# EAGLE design 513_lora_raspberrypi (EAGLE 8.5.1)
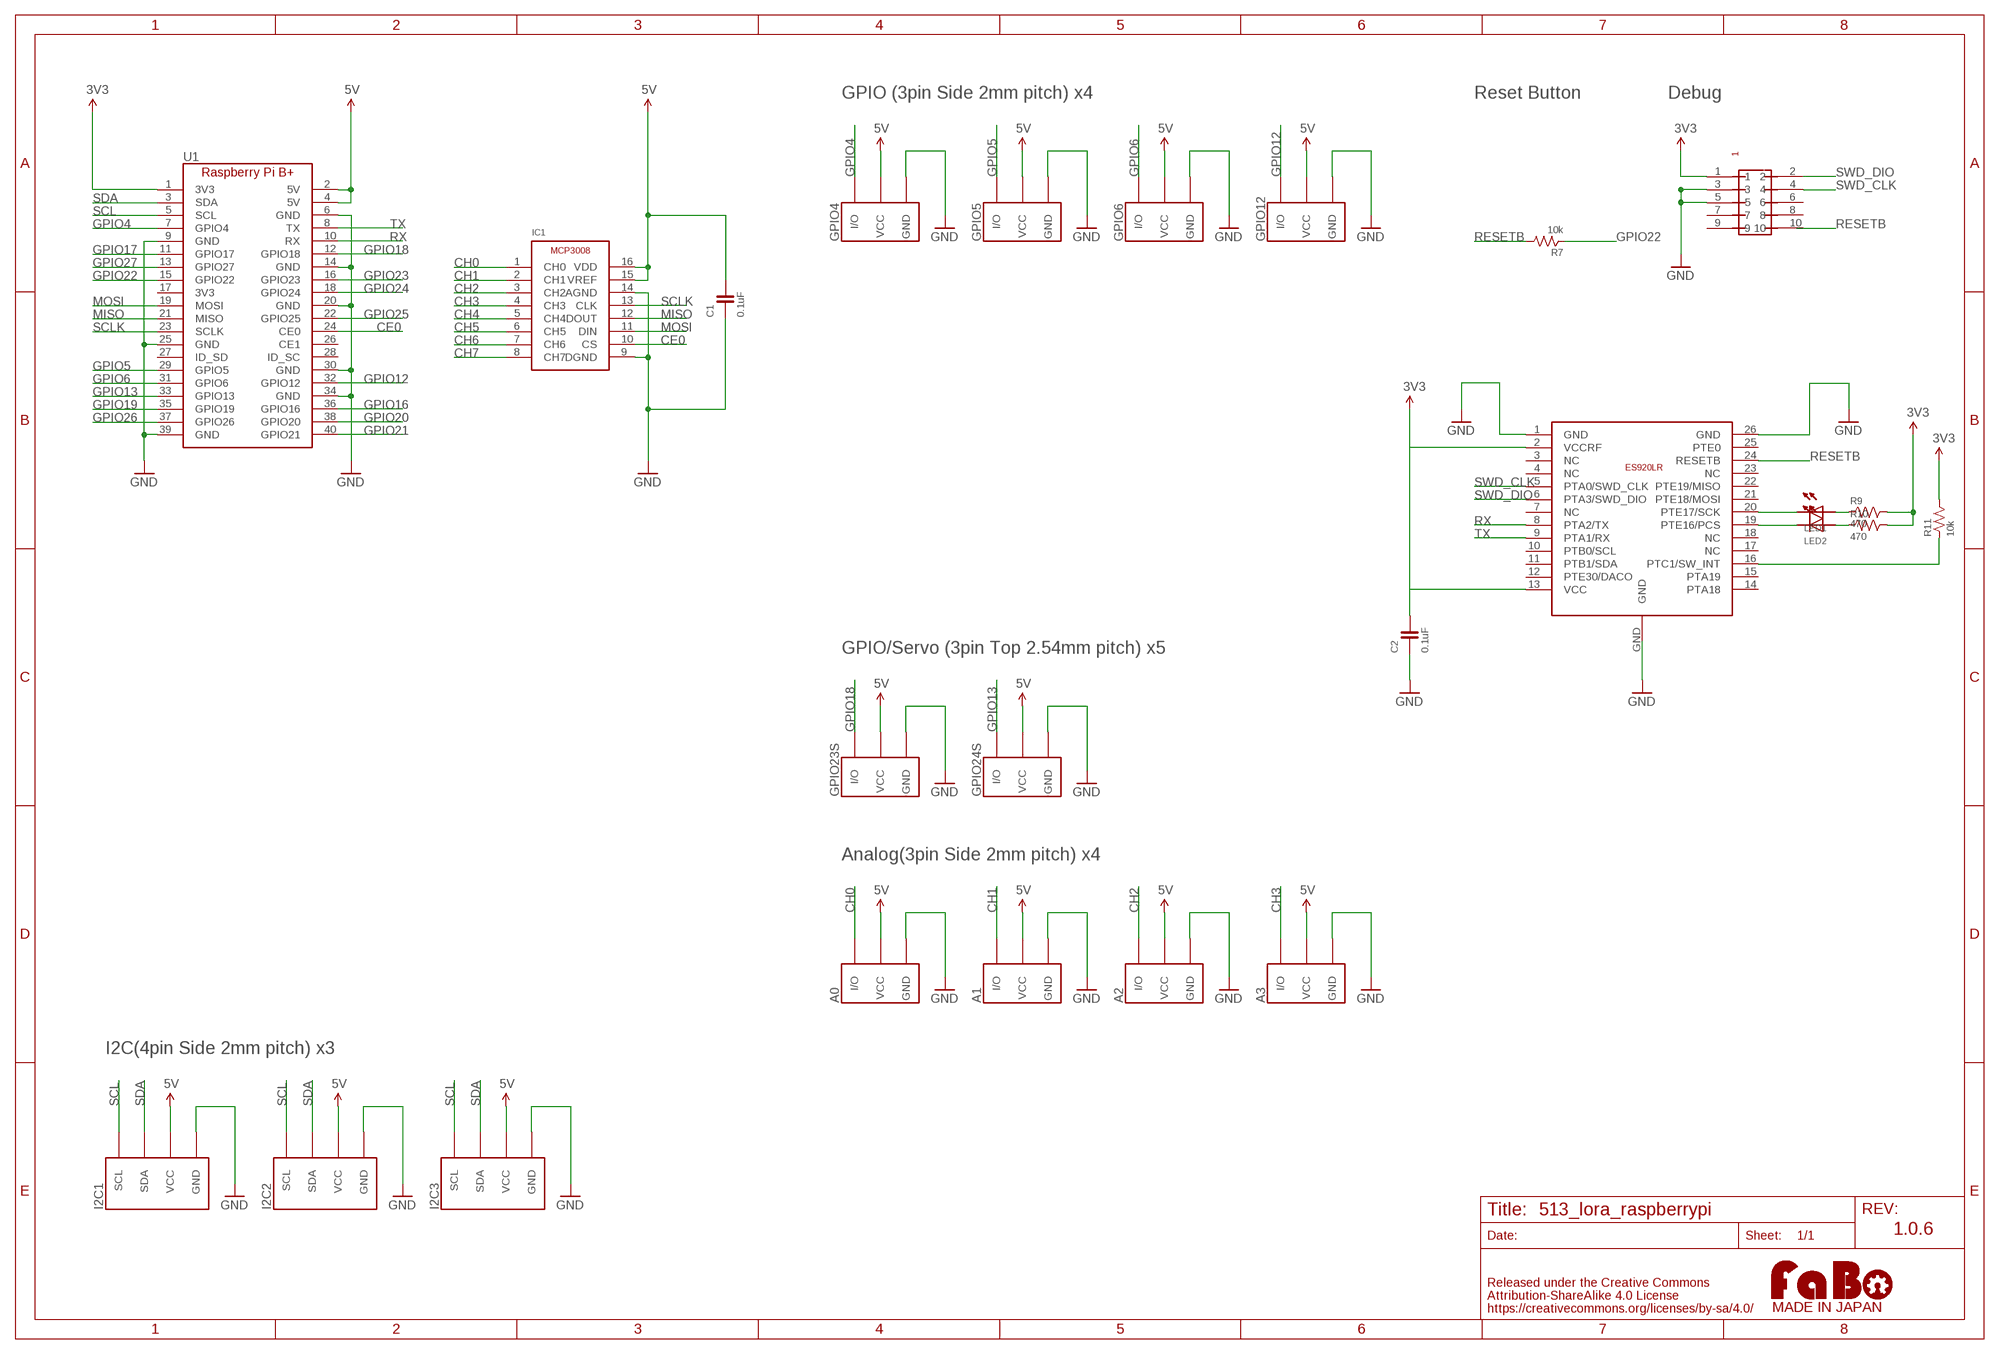
[diagram p0: schematic, sheet 1]

## Parts
A0  FABO_BRICK_3PIN-B03B-PASK-1  [FABO_BRICK_3PIN_B03B-PASK-1]
A1  FABO_BRICK_3PIN-B03B-PASK-1  [FABO_BRICK_3PIN_B03B-PASK-1]
A2  FABO_BRICK_3PIN-B03B-PASK-1  [FABO_BRICK_3PIN_B03B-PASK-1]
A3  FABO_BRICK_3PIN-B03B-PASK-1  [FABO_BRICK_3PIN_B03B-PASK-1]
C1  0.1uF  CAPACITOR-0603  [0603]
C2  0.1uF  CAPACITOR-0603_NARROW  [0603-NARROW]
GPIO4  FABO_BRICK_3PIN-S03B-PASK-2  [FABO_BRICK_3PIN_S03B-PASK-2]
GPIO5  FABO_BRICK_3PIN-S03B-PASK-2  [FABO_BRICK_3PIN_S03B-PASK-2]
GPIO6  FABO_BRICK_3PIN-S03B-PASK-2  [FABO_BRICK_3PIN_S03B-PASK-2]
GPIO12  FABO_BRICK_3PIN-S03B-PASK-2  [FABO_BRICK_3PIN_S03B-PASK-2]
GPIO23S  FABO_BRICK_3PIN-HEADER  [FABO_BRICK_3PIN_HEADER]
GPIO24S  FABO_BRICK_3PIN-HEADER  [FABO_BRICK_3PIN_HEADER]
I2C1  FABO_BRICK_I2C-S04B-PASK-2  [FABO_BRICK_I2C_S04B-PASK-2]
I2C2  FABO_BRICK_I2C-S04B-PASK-2  [FABO_BRICK_I2C_S04B-PASK-2]
I2C3  FABO_BRICK_I2C-S04B-PASK-2  [FABO_BRICK_I2C_S04B-PASK-2]
IC1  MICROCHIP-MCP3008  [MICROCHIP-MCP3008]
LED1  LED-0603  [0603]
LED2  LED-0603  [0603]
R7  10k  RESISTOR-0603-NARROW  [0603-NARROW]
R9  470  RESISTOR-0603-NARROW  [0603-NARROW]
R10  470  RESISTOR-0603-NARROW  [0603-NARROW]
R11  10k  RESISTOR-0603-NARROW  [0603-NARROW]
U1  RASPBERRY_PI_B+  [RASPBERRY_PI_B+]
U$14  LOGO_FABO-M  [LOGO_FABO_MS]
U$15  PIN-HEADER-SMT(1.27MM)2X5  [PIN-HEADER-SMT(1.27MM)2X5]
U$16  ES920LR  [ES920LR]

## Nets
3V3: C2.2 R9.2 R10.2 R11.2 U1.1(3V3) U$15.1 U$16.2(VCCRF) U$16.13(VCC)
5V: A0.VCC A1.VCC A2.VCC A3.VCC C1.2 GPIO4.VCC GPIO5.VCC GPIO6.VCC GPIO12.VCC GPIO23S.VCC GPIO24S.VCC I2C1.VCC I2C2.VCC I2C3.VCC IC1.15(VREF) IC1.16(VDD) U1.2(5V) U1.4(5V)
CE0: IC1.10(CS) U1.24(CE0)
CH0: A0.I/O IC1.1(CH0)
CH1: A1.I/O IC1.2(CH1)
CH2: A2.I/O IC1.3(CH2)
CH3: A3.I/O IC1.4(CH3)
CH4: IC1.5(CH4)
CH5: IC1.6(CH5)
CH6: IC1.7(CH6)
CH7: IC1.8(CH7)
GND: A0.GND A1.GND A2.GND A3.GND C1.1 C2.1 GPIO4.GND GPIO5.GND GPIO6.GND GPIO12.GND GPIO23S.GND GPIO24S.GND I2C1.GND I2C2.GND I2C3.GND IC1.9(DGND) IC1.14(AGND) U1.6(GND) U1.9(GND) U1.14(GND) U1.20(GND) U1.25(GND) U1.30(GND) U1.34(GND) U1.39(GND) U$15.3 U$15.5 U$16.1(GND) U$16.26(GND) U$16.GND
GPIO4: GPIO4.I/O U1.7(GPIO4)
GPIO5: GPIO5.I/O U1.29(GPIO5)
GPIO6: GPIO6.I/O U1.31(GPIO6)
GPIO12: GPIO12.I/O U1.32(GPIO12)
GPIO13: GPIO24S.I/O U1.33(GPIO13)
GPIO16: U1.36(GPIO16)
GPIO17: U1.11(GPIO17)
GPIO18: GPIO23S.I/O U1.12(GPIO18)
GPIO19: U1.35(GPIO19)
GPIO20: U1.38(GPIO20)
GPIO21: U1.40(GPIO21)
GPIO22: R7.1 U1.15(GPIO22)
GPIO23: U1.16(GPIO23)
GPIO24: U1.18(GPIO24)
GPIO25: U1.22(GPIO25)
GPIO26: U1.37(GPIO26)
GPIO27: U1.13(GPIO27)
MISO: IC1.12(DOUT) U1.21(MISO)
MOSI: IC1.11(DIN) U1.19(MOSI)
N$4: LED2.CATHODE U$16.19(PTE16/PCS)
N$5: LED1.CATHODE U$16.20(PTE17/SCK)
N$6: LED1.ANODE R9.1
N$7: LED2.ANODE R10.1
N$8: R11.1 U$16.16(PTC1/SW_INT)
RESETB: R7.2 U$15.10 U$16.24(RESETB)
RX: U1.10(RX) U$16.8(PTA2/TX)
SCL: I2C1.SCL I2C2.SCL I2C3.SCL U1.5(SCL)
SCLK: IC1.13(CLK) U1.23(SCLK)
SDA: I2C1.SDA I2C2.SDA I2C3.SDA U1.3(SDA)
SWD_CLK: U$15.4 U$16.5(PTA0/SWD_CLK)
SWD_DIO: U$15.2 U$16.6(PTA3/SWD_DIO)
TX: U1.8(TX) U$16.9(PTA1/RX)
Unconnected: U1.17(3V3) U1.26(CE1) U1.27(ID_SD) U1.28(ID_SC) U$15.6 U$15.7 U$15.8 U$15.9 U$16.3(NC) U$16.4(NC) U$16.7(NC) U$16.10(PTB0/SCL) U$16.11(PTB1/SDA) U$16.12(PTE30/DACO) U$16.14(PTA18) U$16.15(PTA19) U$16.17(NC) U$16.18(NC) U$16.21(PTE18/MOSI) U$16.22(PTE19/MISO) U$16.23(NC) U$16.25(PTE0)

## Notes on the sheet
- GPIO (3pin Side 2mm pitch) x4 | Reset Button | Debug
- GPIO/Servo (3pin Top 2.54mm pitch) x5
- Analog(3pin Side 2mm pitch) x4
- I2C(4pin Side 2mm pitch) x3
- 1.0.6

## Library data of the parts
A0 A1-A3 GPIO4-GPIO6 GPIO12 GPIO23S GPIO24S = FaBo-Template:FABO_BRICK_3PIN: FaBo Brick 3pin
C1 C2 = FaBo-Capacitor:CAPACITOR: CAPACITOR
I2C1-I2C3 = FaBo-Template:FABO_BRICK_I2C: FaBo Brick I2C
IC1 = FaBo-ADC:MICROCHIP-MCP3008
LED1 LED2 = FaBo-LED:LED
R7 R9-R11 = FaBo-Resistors:RESISTOR: RESISTOR
U1 = FaBo-Boards:RASPBERRY_PI_B+
U$14 = FaBo-etc:LOGO_FABO
U$15 = GClue:PIN-HEADER-SMT(1.27MM)2X5: PIN-HEADER-SMT (1.27MM) 2x5
U$16 = FaBo-LoRa:ES920LR

## Board
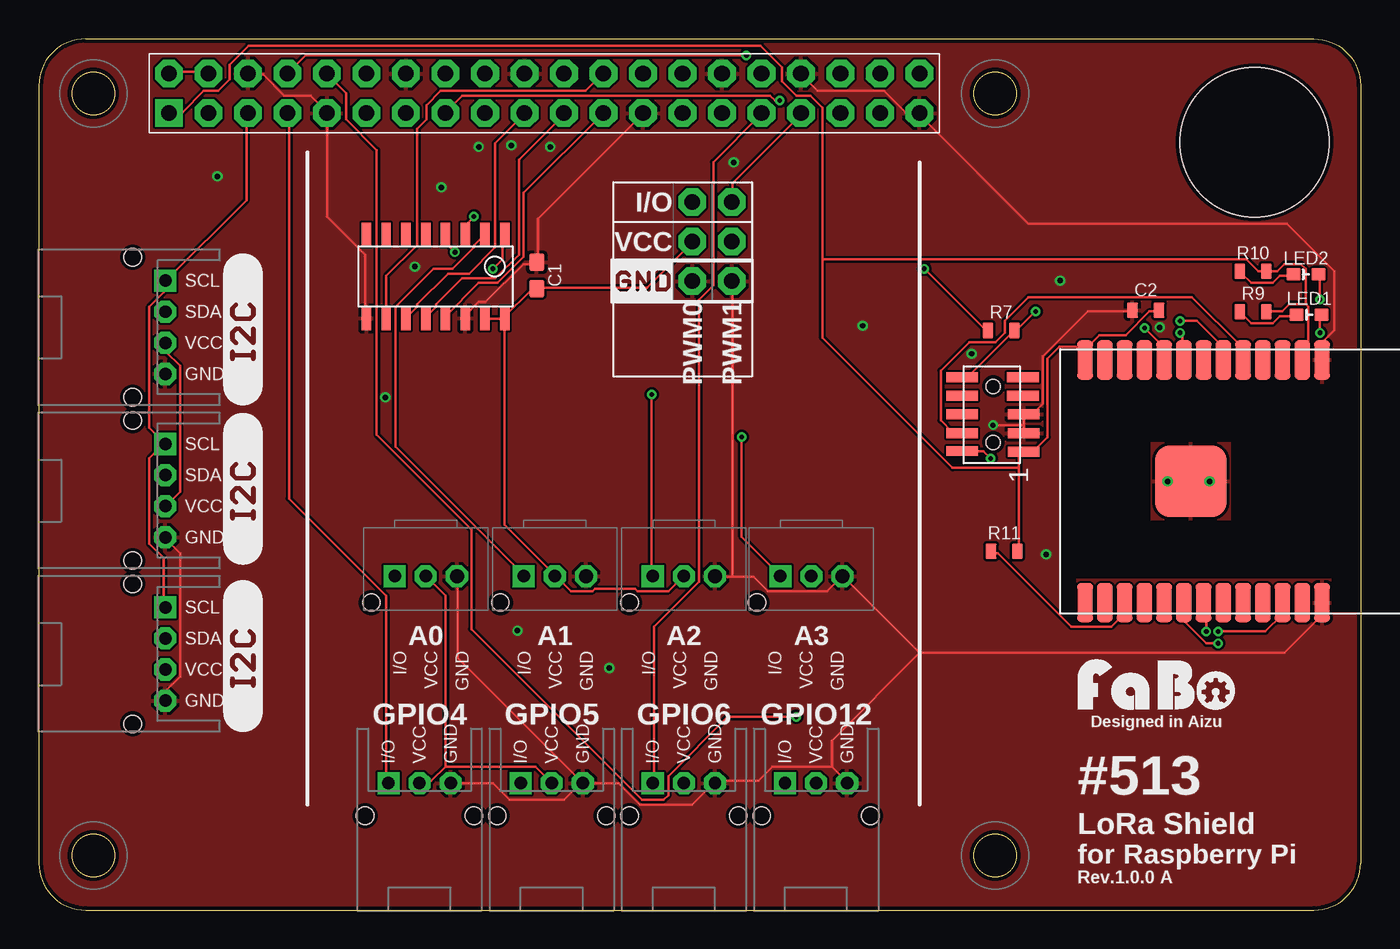
[diagram p1: board, top side]
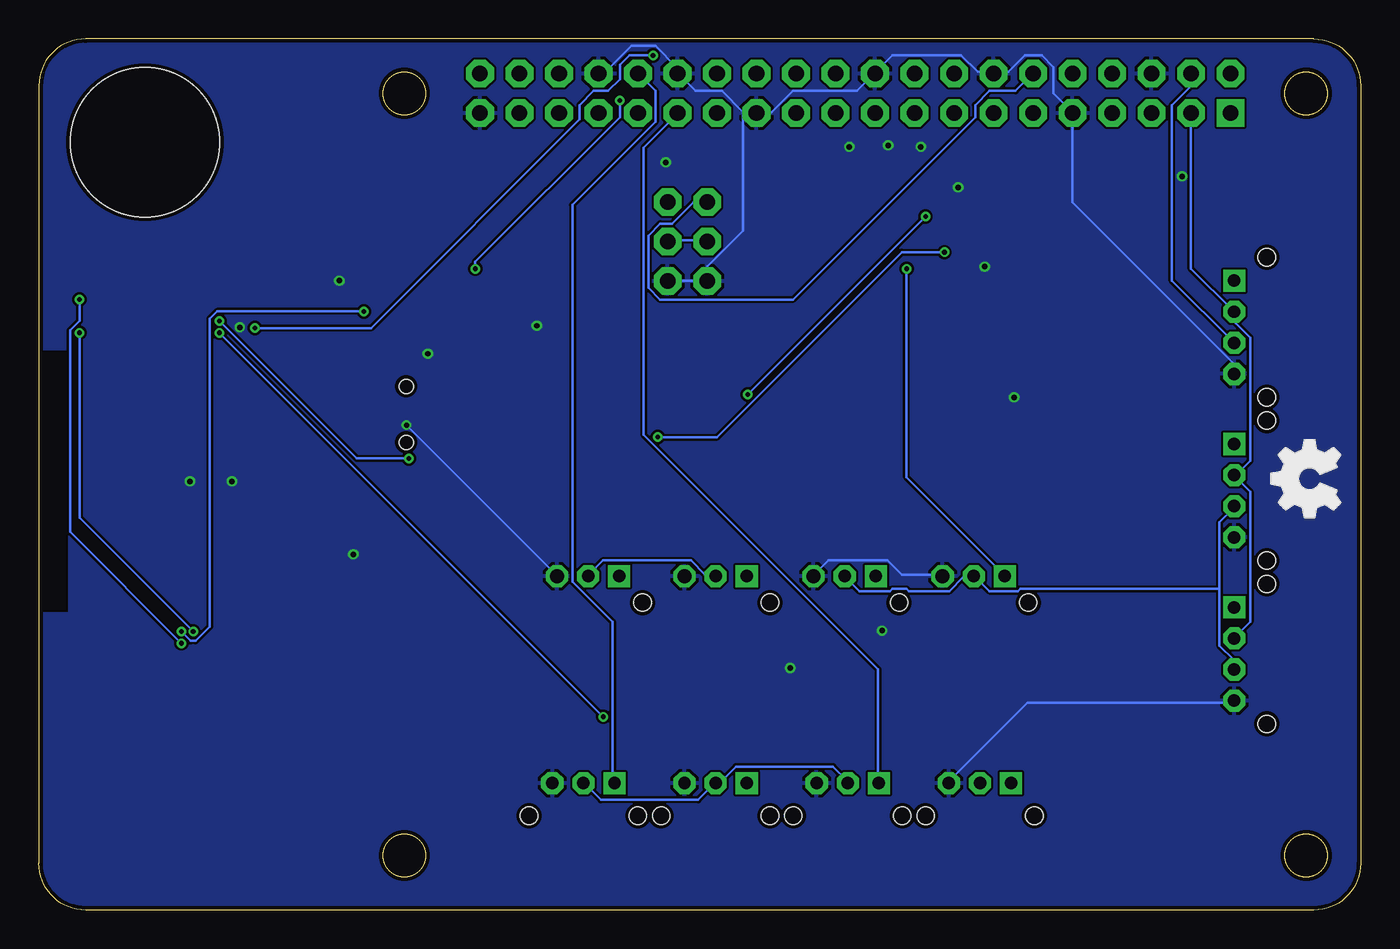
[diagram p2: board, bottom side, seen from below]

Size 85 x 56 mm. Coordinates in mm from the lower left corner, seen from the top.
Copper layers (1*16): Top 0.035mm / dielectric 1.6mm / Bottom 0.035mm
Design rules "PCBway": minimum track width 6mil, minimum drill 12mil, track to track 6mil, track to pad 6mil, pad to pad 6mil, via to via 6mil, smd to smd 6mil, copper to edge 10mil, drill to drill 10mil, minimum pad ring 10mil, minimum via ring 6mil, stop-mask expansion 2mil, vias tented up to drill 100mil, thermal gap 8mil
Holes 9.6 mm at 78.18,49.36

### Footprints (pad centres in the part's own frame; a part is rotated, then mirrored left to right if it is on the bottom)
FABO_BRICK_3PIN_B03B-PASK-1 = drill 0.9 pad 1.422 octagon: GND -2,0 | drill 0.8 pad 1.422 square: I/O 2,0 | drill 0.8 pad 1.422 octagon: VCC 0,0 | hole 1.1: 3.5,1.7
0603 = smd 1.1 x 1: 1 -0.85,0; 2 0.85,0
0603-NARROW = smd 0.71 x 1: 1 -0.85,0; 2 0.85,0
FABO_BRICK_3PIN_S03B-PASK-2 = drill 0.8 pad 1.422 octagon: GND -2,0; VCC 0,0 | drill 0.8 pad 1.422 square: I/O 2,0 | hole 1.1: 3.5,2.1; -3.5,2.1
FABO_BRICK_3PIN_HEADER = drill 1 pad 1.778 octagon: GND -2.54,0; I/O 2.54,0; VCC 0,0
FABO_BRICK_I2C_S04B-PASK-2 = drill 0.8 pad 1.422 octagon: GND -3,0; SDA 1,0; VCC -1,0 | drill 0.8 pad 1.422 square: SCL 3,0 | hole 1.1: 4.5,2.1; -4.5,2.1
MICROCHIP-MCP3008 = smd 0.6 x 1.5: 1 -4.445,-2.7; 2 -3.175,-2.7; 3 -1.905,-2.7; 4 -0.635,-2.7; 5 0.635,-2.7; 6 1.905,-2.7; 7 3.175,-2.7; 8 4.445,-2.7; 9 4.445,2.7; 10 3.175,2.7; 11 1.905,2.7; 12 0.635,2.7; 13 -0.635,2.7; 14 -1.905,2.7; 15 -3.175,2.7; 16 -4.445,2.7
0603' = smd 0.9 x 0.8: ANODE -0.8,0; CATHODE 0.8,0
RASPBERRY_PI_B+ = drill 1 pad 1.778 square: 1 0,-2.54 | drill 1 pad 1.778 octagon: 2 0,0; 3 2.54,-2.54; 4 2.54,0; 5 5.08,-2.54; 6 5.08,0; 7 7.62,-2.54; 8 7.62,0; 9 10.16,-2.54; 10 10.16,0; 11 12.7,-2.54; 12 12.7,0; 13 15.24,-2.54; 14 15.24,0; 15 17.78,-2.54; 16 17.78,0; 17 20.32,-2.54; 18 20.32,0; 19 22.86,-2.54; 20 22.86,0; 21 25.4,-2.54; 22 25.4,0; 23 27.94,-2.54; 24 27.94,0; 25 30.48,-2.54; 26 30.48,0; 27 33.02,-2.54; 28 33.02,0; 29 35.56,-2.54; 30 35.56,0; 31 38.1,-2.54; 32 38.1,0; 33 40.64,-2.54; 34 40.64,0; 35 43.18,-2.54; 36 43.18,0; 37 45.72,-2.54; 38 45.72,0; 39 48.26,-2.54; 40 48.26,0
PIN-HEADER-SMT(1.27MM)2X5 = smd 0.635 x 2.032: 1 -2.4,-1.95; 2 -2.35,2; 3 -1.2,-1.95; 4 -1.2,2; 5 0,-1.95; 6 0,2; 7 1.2,-1.9; 8 1.2,2; 9 2.4,-1.9; 10 2.4,2 | hole 0.9: 1.8,0; -1.8,0
ES920LR = smd 2.5 x 1: 1 -7.8,5.84; 2 -7.8,4.57; 3 -7.8,3.3; 4 -7.8,2.03; 5 -7.8,0.76; 6 -7.8,-0.51; 7 -7.8,-1.78; 8 -7.8,-3.05; 9 -7.8,-4.32; 10 -7.8,-5.59; 11 -7.8,-6.86; 12 -7.8,-8.13; 13 -7.8,-9.4; 14 7.8,-9.4; 15 7.8,-8.13; 16 7.8,-6.86; 17 7.8,-5.59; 18 7.8,-4.32; 19 7.8,-3.05; 20 7.8,-1.78; 21 7.8,-0.51; 22 7.8,0.76; 23 7.8,2.03; 24 7.8,3.3; 25 7.8,4.57; 26 7.8,5.84 | smd 4.6 x 4.6: GND 0,-2.6

### Placement (x,y rotation side)
A0  24.88,21.46 180 top
A1  33.18,21.46 180 top
A2  41.48,21.46 180 top
A3  49.68,21.46 180 top
C1  32.02,40.8 270 top
C2  71.18,38.56 0 top
GPIO4  24.48,8.16 180 top
GPIO5  32.98,8.16 180 top
GPIO6  41.48,8.16 180 top
GPIO12  49.98,8.16 180 top
GPIO23S  42.02,42.98 90 top
GPIO24S  44.56,42.98 90 top
I2C1  8.13,37.46 90 top
I2C2  8.13,26.96 90 top
I2C3  8.13,16.46 90 top
IC1  25.51,40.73 180 top
LED1  [0603']  81.68,38.26 0 top
LED2  [0603']  81.48,40.86 0 top
LOGO1  [LOGO_FABO_M]  71.87,12.5 0 top
R7  61.88,37.26 0 top
R9  78.08,38.46 0 top
R10  78.08,41.06 0 top
R11  62.08,23.06 0 top
U1  8.37,53.77 0 top
U$2  [LOGO_SILK_I2C]  14.38,22.21 90 top
U$3  LOGO_OSHW-M_BOTTOM  [LOGO_OSHW_M_BOTTOM]  3.29,27.74 270 top
U$5  [LOGO_SILK_I2C]  14.38,11.46 90 top
U$6  [LOGO_SILK_I2C]  14.38,32.46 90 top
U$7  [LOGO_SILK_GND]  36.95,39.17 0 top
U$15  61.38,31.86 90 top
U$16  76.68,27.56 270 top

### Tracks (layer width: path | path; a pad name or v marks a point on that pad's centre or on a via)
3V3
  Top 0.152: 81.47,38.94 80.4,38.94 79.95,38.48 79.03,38.48 R9.2 | 81.47,38.94 81.62,38.78 81.62,35.74 81.32,35.43 U$16.2 | 81.47,38.94 81.47,41.22 81.17,41.53 80.1,41.53 79.64,41.07 79.03,41.07 R10.2 78.88,41.07 78.42,41.07 77.66,41.83 50.38,41.83 | 67.3,36.04 68.21,36.96 69.89,36.96 71.41,38.48 72.02,38.48 C2.2 | 67.3,36.04 67.3,35.43 U$16.13 67.3,36.04 | 63.03,28.42 63.03,29.18 63.18,29.34 U$15.1 63.34,29.49 63.95,29.49 64.86,30.4 64.86,35.43 65.62,36.19 66.69,36.19 66.84,36.04 67.3,36.04 | 63.03,28.42 63.03,23.09 R11.2 | 50.38,41.83 50.38,36.8 58.76,28.42 63.03,28.42 | 50.38,41.83 50.38,51.59 49.62,52.35 48.7,52.35 47.79,53.26 47.79,54.18 46.42,55.55 13.5,55.55 12.28,54.33 12.28,53.41 11.52,52.65 10.6,52.65 9.23,51.28 8.47,51.28 U1.1
5V
  Top 0.152: U1.2 8.47,53.87 10.91,53.87 U1.4 | I2C1.VCC 8.17,36.35 8.17,35.89 9.08,34.97 9.08,26.9 8.17,25.98 I2C2.VCC | 26.15,9.22 25.24,8.3 24.63,8.3 GPIO4.VCC | 26.15,9.22 31.94,9.22 32.86,8.3 GPIO5.VCC | IC1.16 29.96,38.17 31.64,39.85 31.94,39.85 C1.2 32.09,40 39.1,40 42,42.9 GPIO23S.VCC | IC1.15 28.74,38.02 29.81,38.02 IC1.16 | A2.VCC 41.39,21.41 40.48,20.5 38.49,20.5 38.34,20.65 35.75,20.65 35.6,20.5 34.23,20.5 33.31,21.41 A1.VCC 33.16,21.56 29.96,24.76 IC1.16 | 26.15,9.22 26.15,20.19 24.93,21.41 A0.VCC
  Bottom 0.152: 9.08,20.65 9.08,24.92 8.17,25.83 I2C2.VCC | 9.08,20.65 9.08,16.99 8.17,16.08 8.17,15.47 I2C3.VCC | U1.4 10.91,52.96 12.13,51.74 12.13,40.46 8.17,36.5 I2C1.VCC | GPIO5.VCC 33.01,8.3 33.92,9.22 40.17,9.22 41.08,8.3 41.39,8.3 GPIO6.VCC 41.54,8.15 42.61,7.09 48.86,7.09 49.92,8.15 GPIO12.VCC | GPIO24S.VCC 44.44,43.05 42.15,43.05 GPIO23S.VCC | A2.VCC 41.54,21.56 42.15,21.56 43.07,22.48 48.7,22.48 49.62,21.56 A3.VCC | A1.VCC 33.16,21.41 32.25,20.5 30.27,20.5 30.11,20.65 29.2,20.65 29.05,20.5 26.45,20.5 25.54,21.41 24.93,21.41 A0.VCC 24.78,21.41 23.86,20.5 22.03,20.5 21.88,20.65 9.08,20.65
CE0
  Top 0.152: IC1.10 22.34,38.17 22.34,40.77 24.32,42.75 24.32,50.21 24.93,50.82 24.93,51.74 25.84,52.65 35.14,52.65 36.21,53.72 U1.24
CH0  (via drill 0.3)
  Top 0.152: v29.2,41.22 29.81,41.83 29.81,43.36 IC1.1
  Bottom 0.152: v29.2,41.22 29.2,27.81 22.95,21.56 A0.I/O
CH1
  Top 0.152: IC1.2 28.59,43.36 27.98,42.75 27.98,42.59 26.61,41.22 25.39,41.22 22.95,38.78 22.95,29.79 31.18,21.56 A1.I/O
CH2  (via drill 0.3)
  Top 0.152: v27.98,44.58 27.52,44.12 27.52,43.51 IC1.3 | v39.41,33.15 39.41,21.56 A2.I/O
  Bottom 0.152: v39.41,33.15 v27.98,44.58
CH3  (via drill 0.3)
  Top 0.152: v26.76,42.29 26.15,42.9 26.15,43.36 IC1.4 | v45.2,30.4 45.2,24 47.64,21.56 A3.I/O
  Bottom 0.152: v26.76,42.29 29.5,42.29 41.39,30.4 v45.2,30.4
GND  (via drill 0.3, 0.35)
  Top 0.152: U$16.1 82.54,35.43 82.54,36.5 83.3,37.26 83.3,41.07 80.25,44.12 63.64,44.12 56.63,51.13 U1.39 56.63,51.28 55.72,51.28 54.34,52.65 50.08,52.65 49.01,53.72 U1.34 | IC1.14 27.37,38.17 28.28,39.09 28.74,39.09 31.18,41.53 31.94,41.53 C1.1 32.09,41.68 32.09,44.42 38.8,51.13 U1.25 | IC1.9 20.97,38.17 20.97,42.14 18.53,44.58 U1.9 18.53,51.28 17.46,52.35 15.79,52.35 14.41,53.72 13.5,53.72 U1.6 | I2C3.GND 8.17,13.49 8.17,14.1 9.08,15.01 9.08,22.93 8.17,23.85 I2C2.GND | GPIO4.GND 26.61,8.15 29.2,8.15 30.27,7.09 33.77,7.09 34.84,8.15 GPIO5.GND | A0.GND 26.91,21.41 26.91,16.23 34.84,8.3 GPIO5.GND | C2.1 70.19,38.48 67.45,38.48 64.56,35.58 64.56,32.54 63.95,31.93 63.34,31.93 U$15.5 63.34,31.77 63.34,31.16 | 63.34,31.16 63.34,30.71 U$15.3 | 50.99,9.22 47.18,9.22 46.27,8.3 43.52,8.3 GPIO6.GND 43.37,8.15 42,6.78 38.65,6.78 37.27,8.15 GPIO5.GND | 50.99,9.22 51.91,8.3 GPIO12.GND | 56.63,16.53 80.1,16.53 82.39,18.82 82.39,19.73 U$16.26 | 56.63,16.53 51.75,21.41 A3.GND 51.6,21.41 50.69,20.5 46.88,20.5 45.96,21.41 44.59,21.41 | 44.59,21.41 43.52,21.41 A2.GND | 50.99,9.22 50.99,10.9 56.63,16.53 | v61.35,31.16 63.34,31.16 | 44.59,21.41 44.59,40.31 GPIO24S.GND
  Bottom 0.152: GPIO24S.GND 44.44,40.46 42.15,40.46 GPIO23S.GND 42,40.46 42,41.38 39.71,43.66 39.71,51.28 | 39.71,51.28 38.95,51.28 U1.25 | 39.71,51.28 41.08,52.65 42.76,52.65 43.83,53.72 U1.30 43.98,53.87 43.98,54.18 45.35,55.55 46.88,55.55 48.55,53.87 49.01,53.87 U1.34 | 39.71,51.28 U1.25 | I2C1.GND 8.17,34.52 8.17,35.13 18.53,45.49 U1.9 18.53,51.28 19.75,52.5 19.75,54.18 20.51,54.94 21.58,54.94 22.64,53.87 23.56,53.87 U1.14 23.71,53.87 24.63,53.87 25.69,54.94 30.11,54.94 31.18,53.87 U1.20 31.33,53.72 32.4,52.65 36.51,52.65 37.88,51.28 38.8,51.28 U1.25 | A0.GND 26.91,21.56 29.5,21.56 30.42,22.48 34.23,22.48 35.14,21.56 A1.GND | I2C3.GND 8.17,13.33 21.43,13.33 26.45,8.3 GPIO4.GND | v61.35,31.16 51.75,21.56 A3.GND
  other vias: 72.58,27.56 75.28,27.56 52.98,37.56 36.68,15.56 30.78,17.96 25.88,46.46 11.48,47.16 22.28,32.96 65.68,40.46 64.78,22.86 24.18,41.36 28.28,49.06 32.88,49.06 44.68,48.06 30.38,49.16 59.98,35.76 72.08,37.46
  pour Bottom: -0.52,-0.84 -0.52,56.31 85.84,56.31 85.84,-0.84
  pour Top: -0.52,-0.84 -0.52,56.31 84.57,56.31 85.84,56.31 85.84,-0.84
GPIO4
  Top 0.152: GPIO4.I/O 22.34,8.3 22.34,20.19 16.09,26.44 16.09,51.13 U1.7
GPIO5
  Bottom 0.152: GPIO5.I/O 31.03,8.3 31.03,15.47 46.11,30.55 46.11,49 43.98,51.13 U1.29
GPIO6
  Top 0.152: GPIO6.I/O 39.56,8.3 39.56,18.21 42.46,21.11 42.46,39.24 43.37,40.16 43.37,48.08 46.42,51.13 U1.31
GPIO12
  Bottom 0.152: U1.32 45.35,52.65 45.35,50.67 50.69,45.34 50.69,21.11 48.1,18.52 48.1,8.3 GPIO12.I/O
GPIO13
  Top 0.152: GPIO24S.I/O 44.59,45.64 44.59,46.71 49.01,51.13 U1.33
GPIO18
  Bottom 0.152: U1.12 22.19,52.65 23.86,52.65 24.78,51.74 24.78,50.98 36.51,39.24 45.05,39.24 45.81,40 45.81,43.36 45.05,44.12 44.29,44.12 42.91,45.49 42.15,45.49 GPIO23S.I/O
GPIO22  (via drill 0.3)
  Top 0.152: v56.93,41.22 60.9,37.26 R7.1 | v47.64,52.04 47.33,52.04 47.03,52.35 27.22,52.35 26.15,51.28 U1.15
  Bottom 0.152: v56.93,41.22 56.93,41.68 47.64,50.98 v47.64,52.04
MISO
  Top 0.152: IC1.12 24.93,38.17 25.54,38.78 25.54,38.94 27.22,40.61 29.35,40.61 30.87,42.14 30.87,48.23 33.77,51.13 U1.21
MOSI
  Top 0.152: IC1.11 23.71,38.17 24.32,38.78 24.32,38.94 26.3,40.92 27.67,40.92 29.35,42.59 29.35,49.3 31.18,51.13 U1.19
N$4  (via drill 0.3)
  Top 0.152: v82.39,39.24 82.39,40.77 LED2.CATHODE | v75.83,17.14 75.07,17.14 73.7,18.52 73.7,19.73 U$16.19
  Bottom 0.152: v82.39,39.24 82.39,37.87 83,37.26 83,24.31 v75.83,17.14
N$5  (via drill 0.3)
  Top 0.152: v82.39,37.11 82.39,38.17 LED1.CATHODE | v75.07,17.91 75.07,19.58 74.92,19.73 U$16.20
  Bottom 0.152: v82.39,37.11 82.39,25.22 v75.07,17.91
N$6
  Top 0.152: LED1.ANODE 80.86,38.17 79.8,38.17 79.34,37.72 77.97,37.72 77.36,38.33 R9.1
N$7
  Top 0.152: LED2.ANODE 80.56,40.77 79.8,40.77 79.34,40.31 77.97,40.31 77.36,40.92 R10.1
N$8
  Top 0.152: R11.1 61.35,22.93 61.66,22.93 66.38,18.21 68.97,18.21 69.74,18.97 69.74,19.73 U$16.16
RESETB  (via drill 0.3)
  Top 0.152: U$15.10 59.53,34.36 59.83,34.36 R7.2 62.88,37.26 v64.1,38.48 | v75.83,17.91 78.88,17.91 79.95,18.97 79.95,19.73 U$16.24
  Bottom 0.152: v75.83,17.91 75.22,17.3 74.92,17.3 74,18.21 74,38.02 73.55,38.48 v64.1,38.48
RX  (via drill 0.3)
  Top 0.152: v73.39,37.11 73.55,36.96 73.55,35.43 U$16.8 | v48.7,12.42 44.29,12.42 40.48,8.61 40.48,7.39 40.17,7.09 38.8,7.09 27.83,18.06 27.83,24.46 21.73,30.55 21.73,48.84 19.75,50.82 19.75,52.5 18.53,53.72 U1.10
  Bottom 0.152: v48.7,12.42 v73.39,37.11
SCL
  Top 0.152: I2C3.SCL 8.01,19.58 8.01,22.63 7.1,23.54 7.1,29.03 8.01,29.95 I2C2.SCL 8.01,30.1 7.1,31.01 7.1,38.78 8.01,39.7 8.01,40.31 I2C1.SCL 8.17,40.46 13.35,45.64 13.35,51.13 U1.5
SCLK
  Top 0.152: U1.23 31.18,46.1 31.18,41.98 29.5,40.31 28.28,40.31 26.15,38.17 IC1.13
SDA
  Bottom 0.152: I2C3.SDA 8.01,17.6 7.1,18.52 7.1,26.9 8.01,27.81 I2C2.SDA 8.01,27.96 7.1,28.88 7.1,36.8 8.01,37.72 8.01,38.33 I2C1.SDA 8.17,38.48 10.91,41.22 U1.3
SWD_CLK
  Top 0.152: U$15.4 59.37,30.71 58.76,30.71 58,31.47 58,34.67 59.83,36.5 61.51,36.5 62.12,37.11 62.12,37.87 63.64,39.39 74.16,39.39 77.36,36.19 77.36,35.43 U$16.5
SWD_DIO  (via drill 0.3)
  Top 0.152: v61.2,29.03 60.74,29.49 59.53,29.49 U$15.2 | v73.39,37.87 74.46,37.87 76.14,36.19 76.14,35.43 U$16.6
  Bottom 0.152: v61.2,29.03 64.56,29.03 v73.39,37.87
TX  (via drill 0.3)
  Top 0.152: v71.11,37.41 72.33,36.19 72.33,35.43 U$16.9 | v45.5,54.94 17.16,54.94 U1.8
  Bottom 0.152: v71.11,37.41 63.64,37.41 50.23,50.82 50.23,51.74 49.31,52.65 48.4,52.65 47.64,53.41 47.64,54.33 47.03,54.94 v45.5,54.94

### Text on the board
tPlace: I/O | VCC | SCL | PWM0 | PWM1 | SDA | VCC | GND | SCL | SDA | VCC | GND | SCL | SDA | I/O | VCC | GND | I/O | VCC | GND | I/O | VCC | GND | I/O | VCC | GND | VCC | GND | Designed in Aizu | I/O | VCC | GND | I/O | VCC | GND | I/O | VCC | GND | I/O | VCC | GND | #513 | LoRa Shield | for Raspberry Pi | Rev.1.0.0 A